# EAGLE design CoinLogger (EAGLE 6.2)
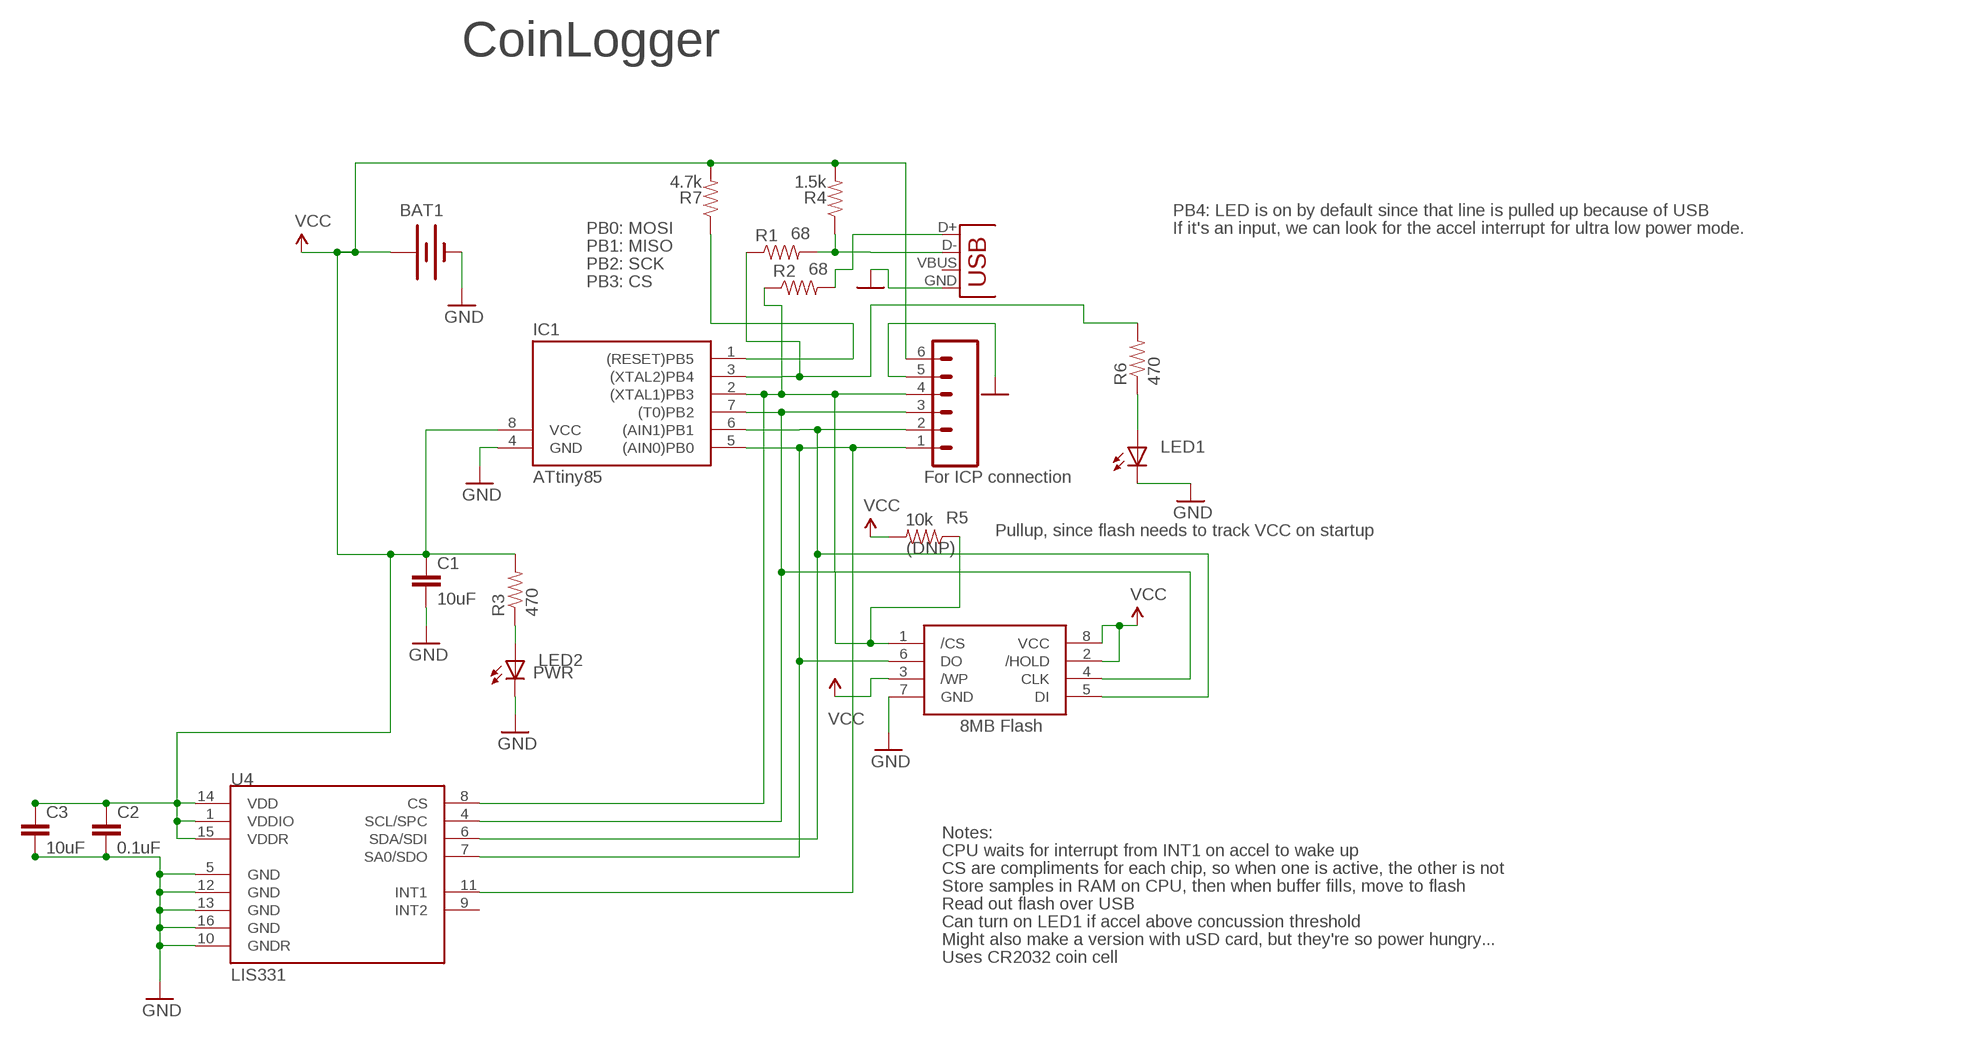
[diagram p0: schematic, sheet 1]

## Parts
BAT1  BATTERY20SMD  [BATTCON_20MM]
C1  10uF  CAP0402-CAP  [0402-CAP]
C2  0.1uF  CAP0402-CAP  [0402-CAP]
C3  10uF  CAP0402-CAP  [0402-CAP]
IC1  TINY11S  [SOIC8]
JP2  M061X06-SMD_EDGE_FEMALE  [1X06-SMD_EDGE]
LED1  LED0603  [LED-0603]
LED2  LED0603  [LED-0603]
R1  68  RESISTOR0402-RES  [0402-RES]
R2  68  RESISTOR0402-RES  [0402-RES]
R3  470  RESISTOR0402-RES  [0402-RES]
R4  1.5k  RESISTOR0402-RES  [0402-RES]
R5  10k  RESISTOR0402-RES  [0402-RES]
R6  470  RESISTOR0402-RES  [0402-RES]
R7  4.7k  RESISTOR0402-RES  [0402-RES]
U4  LIS331  [LGA16-3MM]
U$1  W25Q80BV  [SOIC8]
X1  USB-MICROB  [USB-MICROB]

## Nets
GND: BAT1.2(-) C1.2 C2.2 C3.2 IC1.4(GND) JP2.5 LED1.C LED2.C U4.5(GND) U4.10(GNDR) U4.12(GND) U4.13(GND) U4.16(GND) U$1.7(GND) X1.GND
N$2: R2.2 X1.D+
N$3: LED2.A R3.1
N$4: IC1.2((XTAL1)PB3) JP2.4 R2.1 R5.1 U4.8(CS) U$1.1(/CS)
N$5: IC1.7((T0)PB2) JP2.3 U4.4(SCL/SPC) U$1.4(CLK)
N$6: IC1.5((AIN0)PB0) JP2.1 U4.7(SA0/SDO) U4.11(INT1) U$1.6(DO)
N$7: IC1.6((AIN1)PB1) JP2.2 U4.6(SDA/SDI) U$1.5(DI)
N$8: R1.2 R4.1 X1.D-
N$9: IC1.1((RESET)PB5) R7.1
N$10: LED1.A R6.1
N$13: IC1.3((XTAL2)PB4) R1.1 R6.2
VCC: BAT1.1(+) C1.1 C2.1 C3.1 IC1.8(VCC) JP2.6 R3.2 R4.2 R5.2 R7.2 U4.1(VDDIO) U4.14(VDD) U4.15(VDDR) U$1.2(/HOLD) U$1.3(/WP) U$1.8(VCC)
Unconnected: U4.9(INT2) X1.VBUS

## Notes on the sheet
- CoinLogger
- PB4: LED is on by default since that line is pulled up because of USB
- PB0: MOSI | If it's an input, we can look for the accel interrupt for ultra low power mode.
- PB1: MISO
- PB2: SCK
- PB3: CS
- ATtiny85 | For ICP connection
- Pullup, since flash needs to track VCC on startup
- (DNP)
- PWR
- 8MB Flash
- Notes:
- CPU waits for interrupt from INT1 on accel to wake up
- CS are compliments for each chip, so when one is active, the other is not
- Store samples in RAM on CPU, then when buffer fills, move to flash
- Read out flash over USB
- Can turn on LED1 if accel above concussion threshold
- Might also make a version with uSD card, but they're so power hungry...
- Uses CR2032 coin cell

## Library data of the parts
BAT1 = SparkFun:BATTERY: Battery Holders Various common sizes : AA, AAA, 20mm coin cell and 12mm coin cell.
C1-C3 = SparkFun:CAP: Capacitor Standard 0603 ceramic capacitor, and 0.1" leaded capacitor.
IC1 = atmel:TINY11*: MICROCONTROLLER 1 Kbytes FLASH; OC_FARNELL: 3617970; OC_NEWARK: unknown
JP2 = SparkFun:M06: Header 6 Standard 6-pin 0.1" header. Use with straight break away headers (SKU : PRT-00116), right angle break away headers (PRT-00553), swiss pins (PRT-00743), machine pins (PRT-00117), and female headers (PRT-00115). Molex polarized connector foot print use with SKU : PRT-08094 with associated crimp pins and housings. NOTES ON THE VARIANTS LOCK and LOCK_LONGPADS... This footprint was designed to help hold the alignment of a through-hole component (i.e. 6-pin header) while soldering it into place. You may notice that each hole has been shifted either up or down by 0.005 of an inch from it's more standard position (which is a perfectly straight line). This slight alteration caused the pins (the squares in the middle) to touch the edges of the holes. Because they are alternating, it causes a "brace" to hold the component in place. 0.005 has proven to be the perfect amount of "off-center" position when using our standard breakaway headers. Although looks a little odd when you look at the bare footprint, once you have a header in there, the alteration is very hard to notice. Also, if you push a header all the way into place, it is covered up entirely on the bottom side. This idea of altering the position of holes to aid alignment will be further integrated into the Sparkfun Library for other footprints. It can help hold any component with 3 or more connection pins.
LED1 LED2 = SparkFun:LED: LEDs Standard schematic elements and footprints for 5mm, 3mm, 1206, and 0603 sized LEDs. 5mm - Spark Fun Electronics SKU : COM-00529 (and others)
R1-R7 = SparkFun:RESISTOR: Resistor Basic schematic elements and footprints for 0603, 1206, and PTH resistors.
U4 = SparkFun:LIS331: LIS331HH 3-axis accelerometer
U$1 = W25Q80BV:W25Q80BV
X1 = SparkFun:USB: USB Connectors USB-B-PTH is fully proven SKU : PRT-00139 USB-miniB is fully proven SKU : PRT-00587 USB-A-PCB is untested. USB-A-H is throughly reviewed, but untested. Spark Fun Electronics SKU : PRT-00437 USB-B-SMT is throughly reviewed, but untested. Needs silkscreen touching up. USB-A-S has not been used/tested USB-MB-H has not been used/tested

## Board
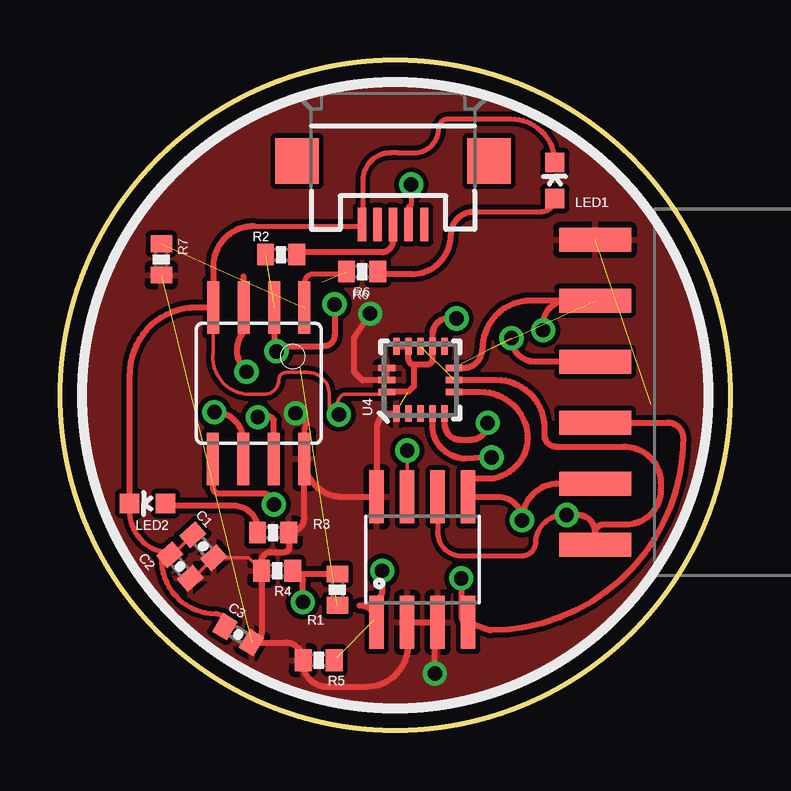
[diagram p1: board, top side]
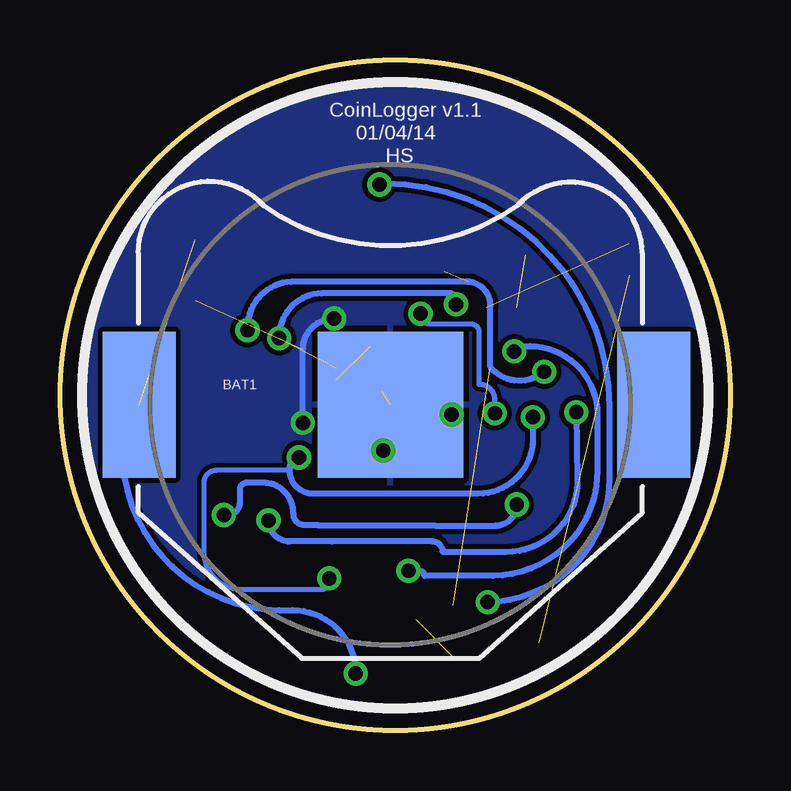
[diagram p2: board, bottom side, seen from below]

Size 27.94 x 27.94 mm. Coordinates in mm from the lower left corner, seen from the top.
Outline: circle at 13.97,13.97 radius 13.97
Copper layers (1*16): Top 0.035mm / dielectric 1.5mm / Bottom 0.035mm
Design rules: minimum track width 6mil, minimum drill 13mil, track to track 8mil, track to pad 8mil, pad to pad 8mil, via to via 8mil, smd to smd 8mil, copper to edge 40mil, drill to drill 8mil, minimum pad ring 10mil, minimum via ring 8mil, stop-mask expansion 4mil, vias tented up to drill 25mil, thermal gap 10mil

### Footprints (pad centres in the part's own frame; a part is rotated, then mirrored left to right if it is on the bottom)
BATTCON_20MM = smd 3.035 x 6.07: 1 -10.468,0; 3 10.976,0 | smd 6.07 x 6.07: 2 0,0
0402-CAP = smd 0.7 x 0.9: 1 -0.65,0; 2 0.65,0
SOIC8 = smd 0.5 x 2.2: 1 -1.905,-3.154; 2 -0.645,-3.154; 3 0.625,-3.154; 4 1.895,-3.154; 5 1.905,3.154; 6 0.635,3.154; 7 -0.635,3.154; 8 -1.905,3.154
1X06-SMD_EDGE = smd 1 x 3: 1 0,-0.08; 2 2.54,-0.08; 3 5.08,-0.08; 4 7.62,-0.08; 5 10.16,-0.08; 6 12.7,-0.08
LED-0603 = smd 0.8 x 0.8: A 0,-0.75; C 0,0.75
0402-RES = smd 0.7 x 0.9: 1 -0.65,0; 2 0.65,0
LGA16-3MM = smd 0.7 x 0.28: 1 -1.4,1; 2 -1.4,0.5; 3 -1.4,0; 4 -1.4,-0.5; 5 -1.4,-1; 9 1.4,-1; 10 1.4,-0.5; 11 1.4,0; 12 1.4,0.5; 13 1.4,1 | smd 0.28 x 0.7: 6 -0.5,-1.4; 7 0,-1.4; 8 0.5,-1.4; 14 0.5,1.4; 15 0,1.4; 16 -0.5,1.4
SOIC8' = smd 0.61 x 2.21: 1 -1.905,-2.616; 2 -0.635,-2.616; 3 0.635,-2.616; 4 1.905,-2.616; 5 1.905,2.616; 6 0.635,2.616; 7 -0.635,2.616; 8 -1.905,2.616
USB-MICROB = smd 0.35 x 1.4: D+ 0,2.65; D- -0.65,2.65; GND 1.3,2.65; ID 0.65,2.65; VBUS -1.3,2.65 | smd 1.8 x 1.9: MT1 -4,0; MT2 4,0

### Placement (x,y rotation side)
BAT1  14.18,13.58 0 bottom
C1  5.97,7.68 132.1 top
C2  5,6.83 131.2 top
C3  7.43,4 149.1 top
IC1  8.28,14.47 180 top
JP2  22.22,7.75 90 top
LED1  20.61,22.92 0 top
LED2  3.65,9.46 90 top
R1  11.56,5.87 90 top
R2  9.21,19.83 0 top
R3  8.88,8.25 0 top
R4  9.05,6.66 180 top
R5  10.78,2.93 180 top
R6  12.59,19.12 180 top
R7  4.22,19.63 270 top
U4  15.02,14.61 90 top
U$1  W25Q80BV  [SOIC8']  15.1,7.12 0 top
X1  13.88,23.73 180 top

### Tracks (layer width: path | path; a pad name or v marks a point on that pad's centre or on a via)
GND  (via drill 0.6)  (2 unrouted)
  Top 0.152: 6.38,18.33 6.38,15.76 arc90 7.72,14.02 8.52,14.02 arc90 9.12,14.62 arc-90 9.42,14.92 10.32,14.92 arc-90 11.22,14.02 11.22,13.57 arc90 v11.62,13.17 arc-90 11.82,14.02 13.53,14.02 arc90 U4.16 | C2.2 4.69,7.32 C1.2 | U$1.7 14.46,11.46 arc-90 v14.47,11.67
  Top 0.203: 4.77,7.42 4.67,7.42 4.22,7.17 arc90 6.47,4.87 arc-106 C3.2 | 4.77,7.42 arc-90 C2.2 | LED2.C 2.9,8.99 arc90 4.77,7.42 | 8.08,21.02 12.51,21.02 arc90 X1.GND arc90 X1.GND 12.62,21.07 12.62,22.21 12.62,22.92 arc-90 13.77,24.07 14.09,24.07 14.76,24.07 arc90 15.78,25.08 arc-90 16.18,25.48 18.78,25.48 18.8,25.48 arc-90 LED1.C 20.61,23.75
  Top 0.254: 8.08,21.02 arc90 6.38,19.32 6.38,18.33 IC1.4 arc90 IC1.4 5.67,17.62 arc90 2.9,14.85 LED2.C | U4.13 U4.12 14.52,15.47 arc90 14.74,15.25 | 14.74,15.25 15.29,15.25 arc90 15.52,15.48 U4.10 15.52,16.52 arc-90 16.17,17.17 v16.52,17.17 | U4.13 14.02,16.19 | U4.13 arc-90 U4.13 | 14.74,15.25 14.74,14.34 14.52,14.12 U4.16 arc-90 U4.16 | U4.5 16.02,12.77 arc90 16.67,12.12 17.12,12.12 arc90 v17.82,12.82
  Bottom 0.152: 11.4,13.34 arc-90 v11.62,13.17 arc90 13.12,11.62 14.42,11.62 arc-90 14.47,11.57 v14.47,11.67
  Bottom 0.254: v17.82,12.82 17.82,15.87 arc90 v16.52,17.17
  pour Bottom: 10.57,30.02 17.22,30.07 26.42,25.02 30.67,16.52 30.37,8.67 24.02,-0.33 16.17,-3.48 9.27,-2.93 1.02,2.52 -2.78,10.42 -1.58,20.52 3.52,26.87
N$2
  Top 0.203: 13.87,20.42 X1.D+ arc-90 X1.D+
  Top 0.254: 13.87,20.42 arc-90 13.43,19.93 9.96,19.93 arc90 R2.2
N$3
  Top 0.254: R3.1 arc90 7.37,9.36 4.5,9.36 arc-90 LED2.A
N$4  (via drill 0.6)  (3 unrouted)
  Top 0.254: 12.48,5.22 arc-90 U$1.1 arc-90 13.09,4.61 13.09,5.46 arc90 13.42,5.79 v13.42,6.66 | 11.56,3.06 arc-90 R5.1 | IC1.2 8.92,16.14 arc-90 v9.02,15.8 arc-90 9.24,16.02 11,16.02 arc90 11.44,16.46 v11.44,17.76 | JP2.4 19.79,15.37 arc-90 v18.81,16.35
  Bottom 0.254: v9.02,15.8 arc90 8.8,16.02 8.36,16.02 arc90 5.55,13.16 5.55,10.85 arc90 9.9,6.45 12.76,6.45 arc-90 12.97,6.66 v13.42,6.66 | v11.44,17.76 11.44,17.89 arc-90 11.67,18.22 17.04,18.22 arc-90 v18.81,16.35
N$5  (via drill 0.6)
  Top 0.254: JP2.3 22.99,12.83 25.33,12.83 arc-90 25.96,12.2 arc-90 17.93,4.17 U$1.4 arc-90 16.72,4.79 v16.72,6.34 | U4.4 15.52,12.71 arc90 16.9,11.33 v17.98,11.38 | IC1.7 8.91,12.93 arc90 v8.24,13.06
  Bottom 0.203: 18.37,10.85 21.39,10.85 arc-90 21.94,10.35 21.94,7.44 arc-90 20.32,5.87 17.07,5.87 arc-90 16.72,6.22 v16.72,6.34
  Bottom 0.254: v8.24,13.06 8.24,12.41 8.24,12.15 arc90 10.52,9.87 17.39,9.87 arc90 18.37,10.85 arc90 18.04,11.33 v17.98,11.38
N$6  (via drill 0.6)  (1 unrouted)
  Top 0.203: 15.73,9.41 15.73,8.7 15.73,8.27 arc90 16.73,7.28 19.18,7.28 arc90 19.83,7.83 arc-96 v21.11,8.98
  Top 0.254: 16.44,14.59 arc-90 U4.7 17.91,14.61 18.2,14.61 arc-90 20.18,12.63 20.18,12.33 arc90 20.68,11.83 23.53,11.83 arc-90 25.03,10.33 25.03,10.03 arc-90 23.58,8.58 22.62,8.58 arc90 22.3,8.26 | U$1.6 15.73,9.41 | 21.43,8.98 v21.11,8.98 arc90 21.01,8.98 21.58,8.98 arc-90 22.3,8.26 | IC1.5 6.37,10.13 arc90 6.62,9.88 8.45,9.88 arc-90 v8.91,9.42 | JP2.1 22.3,8.26
  Bottom 0.254: v8.91,9.42 arc90 9.79,8.54 12.32,8.54 17.16,8.54 arc-90 17.19,8.57 17.77,8.57 arc90 18.22,9.02 18.22,9.07 arc-90 19.48,10.33 20.15,10.33 arc-90 20.45,10.03 20.45,9.49 arc90 20.96,8.98 | 20.96,8.98 v21.11,8.98 20.96,8.98
N$7  (via drill 0.6)
  Top 0.254: U4.6 16.87,14.11 17.53,14.11 arc-75 19.42,12.67 arc-93 18.12,10.52 17,10.52 U$1.5 18.27,9.74 arc-90 v19.25,8.76 arc-90 20.78,10.29 JP2.2 | 6.37,13.04 6.37,13.26 v6.43,13.27 arc-90 7.64,12.05 IC1.6
  Bottom 0.254: v6.43,13.27 6.38,10.41 arc90 9.35,7.44 11.99,7.44 arc-90 12.43,7.88 16.61,7.88 18.37,7.88 arc90 v19.25,8.76
N$8  (via drill 0.6)
  Top 0.203: v14.63,22.75 14.63,21.94 arc-90 14.53,21.83 X1.D- | X1.D- arc-90 X1.D-
  Top 0.254: R1.2 9.84,6.52 arc-90 R4.1 arc-90 10.12,6.24 v10.12,5.35
  Bottom 0.254: v10.12,5.35 arc-90 5.05,10.52 5.05,13.49 arc-90 14.41,22.8 arc-90 14.66,22.75 v14.63,22.75
N$9  (1 unrouted)
  Top 0.203: 10.18,18.48 10.18,18.64 arc-90 10.57,19.03 11.88,19.03
  Top 0.254: 10.12,18.55 arc-90 10.18,18.48 IC1.1
N$10
  Top 0.203: 17.26,21.62 20.06,21.62 arc90 LED1.A
  Top 0.254: 17.26,21.62 arc90 16.28,20.64 arc-90 14.66,19.02 13.34,19.02 arc-90 R6.1
N$13  (via drill 0.6)  (2 unrouted)
  Top 0.254: 16.8,15.11 arc90 17.6,15.91 arc-90 19.6,17.91 20.02,17.91 21.12,17.91 arc90 20.13,16.92 v20.13,16.68 | 7.65,18.92 IC1.3 7.65,16.61 arc90 v7.77,14.95
  Bottom 0.254: v7.77,14.95 arc90 10.01,15.14 10.01,17.67 arc-90 10.94,18.7 18.31,18.7 arc-90 v20.13,16.68
VCC  (via drill 0.6)  (2 unrouted)
  Top 0.152: C2.1 5.55,6.34 C1.1 7.86,7.2 R4.2
  Top 0.203: v9.82,13.22 arc-90 10.22,12.82 10.22,12.57 arc90 10.18,12.53 IC1.8
  Top 0.254: 13.64,14.59 arc-90 U4.15 | U4.1 13.8,13.21 arc90 13.2,12.61 U$1.8 arc-90 U$1.8 11.76,9.74 arc-90 IC1.8 10.18,8.9 arc-90 R3.2 arc-90 9.57,8.21 9.57,7.66 arc-90 9.35,7.44 8.8,7.44 arc90 8.4,7.04 R4.2 8.4,4.08 arc-90 C3.1 9.39,3.67 arc-90 R5.2 10.13,2.81 arc90 11.11,1.83 12.76,1.83 arc90 14.52,3.59 14.52,4.45 arc90 U$1.2 U$1.3 arc90 15.62,4.39 v15.62,2.38 | 13.64,14.59 U4.15 | U4.15 U4.14 | 13.64,14.59 12.6,14.59 12.27,14.92 12.27,16.37 v12.92,17.37
  Bottom 0.203: v9.82,13.22 9.82,13.77 arc-90 10.47,14.43 10.47,16.58 arc-90 10.77,16.93 12.53,16.93 arc90 v12.92,17.37
  Bottom 0.254: 25.35,11.78 arc-90 18.81,5.02 18.26,5.02 arc90 v15.62,2.38
  Bottom 0.406: BAT1.1 25.35,13.58 25.35,11.78
  pour Top: 3.97,27.37 9.72,30.02 18.12,30.07 26.32,25.07 30.67,16.52 30.32,8.67 23.97,-0.33 16.12,-3.43 9.37,-2.93 1.17,2.47 -2.73,10.47 -1.48,20.42

### Text on the board
bNames: CoinLogger v1.1 | 01/04/14 | HS
_tNames: LED1 | R2 | R6 | U4 | LED2 | C1 | R3 | C2 | R4 | C3 | R1 | R5